# EAGLE design time-shift-r1 (EAGLE 6.5.0)
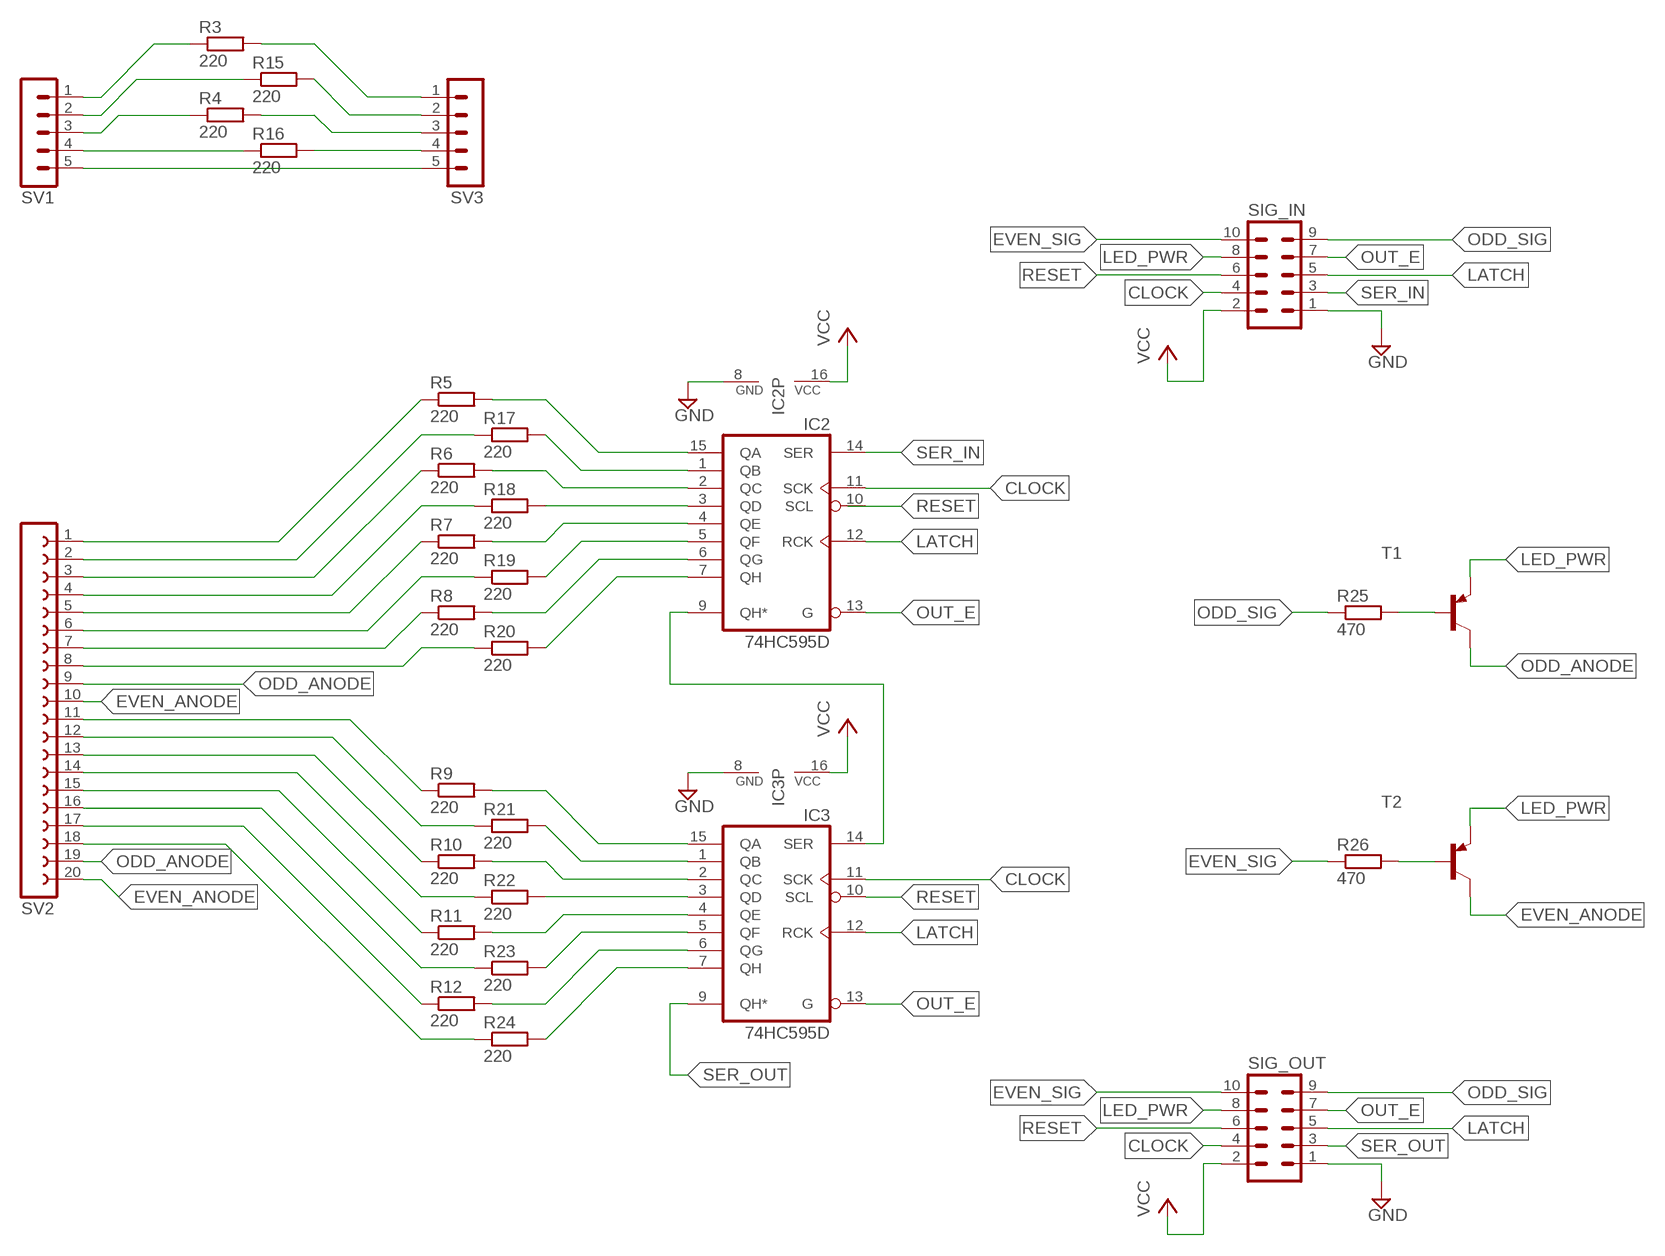
[diagram p0: schematic, sheet 1]

## Parts
IC2  74HC595D  [SO16]
IC3  74HC595D  [SO16]
R3  220  R-EU_R0805  [R0805]
R4  220  R-EU_R0805  [R0805]
R5  220  R-EU_R0805  [R0805]
R6  220  R-EU_R0805  [R0805]
R7  220  R-EU_R0805  [R0805]
R8  220  R-EU_R0805  [R0805]
R9  220  R-EU_R0805  [R0805]
R10  220  R-EU_R0805  [R0805]
R11  220  R-EU_R0805  [R0805]
R12  220  R-EU_R0805  [R0805]
R15  220  R-EU_R0805  [R0805]
R16  220  R-EU_R0805  [R0805]
R17  220  R-EU_R0805  [R0805]
R18  220  R-EU_R0805  [R0805]
R19  220  R-EU_R0805  [R0805]
R20  220  R-EU_R0805  [R0805]
R21  220  R-EU_R0805  [R0805]
R22  220  R-EU_R0805  [R0805]
R23  220  R-EU_R0805  [R0805]
R24  220  R-EU_R0805  [R0805]
R25  470  R-EU_R0805  [R0805]
R26  470  R-EU_R0805  [R0805]
SIG_IN  MA05-2  [MA05-2]
SIG_OUT  MA05-2  [MA05-2]
SV1  MA05-1  [MA05-1]
SV2  FE20-1  [FE20]
SV3  MA05-1  [MA05-1]
T1  BC557B-PNP-TO92-EBC  [TO92-EBC]
T2  BC557B-PNP-TO92-EBC  [TO92-EBC]

## Nets
CLOCK: IC2.11(SCK) IC3.11(SCK) SIG_IN.4 SIG_OUT.4
EVEN_ANODE: SV2.10 SV2.20 T2.C
EVEN_SIG: R26.1 SIG_IN.10 SIG_OUT.10
GND: IC2.8(GND) IC3.8(GND) SIG_IN.1 SIG_OUT.1
LATCH: IC2.12(RCK) IC3.12(RCK) SIG_IN.5 SIG_OUT.5
LED_PWR: SIG_IN.8 SIG_OUT.8 T1.E T2.E
N$1: IC2.15(QA) R5.2
N$2: IC2.2(QC) R6.2
N$3: IC2.4(QE) R7.2
N$4: IC2.6(QG) R8.2
N$5: R20.1 SV2.8
N$6: R19.1 SV2.6
N$7: R18.1 SV2.4
N$8: R17.1 SV2.2
N$9: IC2.1(QB) R17.2
N$10: IC2.3(QD) R18.2
N$11: IC2.5(QF) R19.2
N$12: IC2.7(QH) R20.2
N$13: IC3.15(QA) R9.2
N$14: IC3.2(QC) R10.2
N$15: IC3.4(QE) R11.2
N$16: IC3.6(QG) R12.2
N$17: R24.1 SV2.18
N$18: R23.1 SV2.16
N$19: R22.1 SV2.14
N$20: R21.1 SV2.12
N$21: IC3.1(QB) R21.2
N$22: IC3.3(QD) R22.2
N$23: IC3.5(QF) R23.2
N$24: IC3.7(QH) R24.2
N$25: IC2.9(QH*) IC3.14(SER)
N$26: R5.1 SV2.1
N$27: R6.1 SV2.3
N$28: R7.1 SV2.5
N$29: R8.1 SV2.7
N$30: R9.1 SV2.11
N$31: R10.1 SV2.13
N$32: R11.1 SV2.15
N$33: R12.1 SV2.17
N$36: R16.1 SV1.4
N$37: R4.1 SV1.3
N$38: R3.2 SV3.1
N$39: R4.2 SV3.3
N$40: R15.1 SV1.2
N$41: R3.1 SV1.1
N$42: SV1.5 SV3.5
N$43: R15.2 SV3.2
N$44: R16.2 SV3.4
N$53: R26.2 T2.B
N$54: R25.2 T1.B
ODD_ANODE: SV2.9 SV2.19 T1.C
ODD_SIG: R25.1 SIG_IN.9 SIG_OUT.9
OUT_E: IC2.13(G) IC3.13(G) SIG_IN.7 SIG_OUT.7
RESET: IC3.10(SCL) SIG_IN.6 SIG_OUT.6
SER_IN: IC2.14(SER) SIG_IN.3
SER_OUT: IC3.9(QH*) SIG_OUT.3
VCC: IC2.16(VCC) IC3.16(VCC) SIG_IN.2 SIG_OUT.2
Unconnected: IC2.10(SCL)

## Library data of the parts
IC2 IC3 = 74xx-eu:74*595: 8-bit SHIFT REGISTER, output latch
R3-R12 R15-R26 = rcl:R-EU_: RESISTOR, European symbol
SIG_IN SIG_OUT = con-lstb:MA05-2: PIN HEADER; OC_FARNELL: unknown; OC_NEWARK: unknown
SV1 SV3 = con-lstb:MA05-1: PIN HEADER; OC_FARNELL: unknown; OC_NEWARK: unknown
SV2 = con-lsta:FE20-1: FEMALE HEADER; OC_FARNELL: unknown; OC_NEWARK: unknown
T1 T2 = transistor:*-PNP-: PNP Transistror

## Board
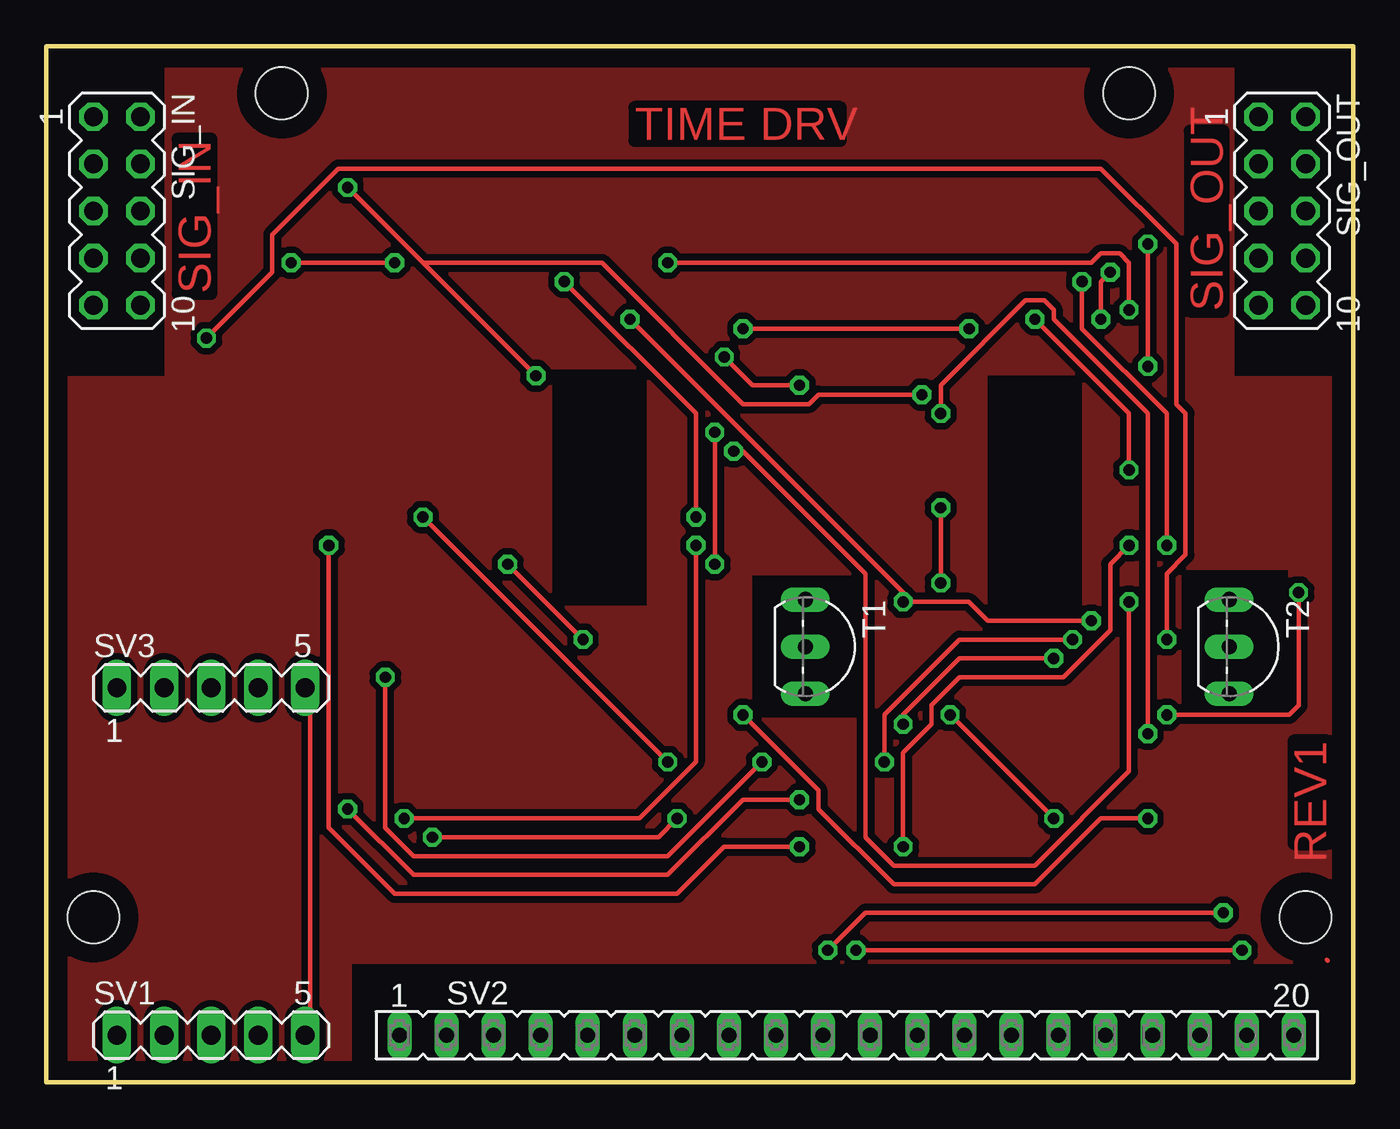
[diagram p1: board, top side]
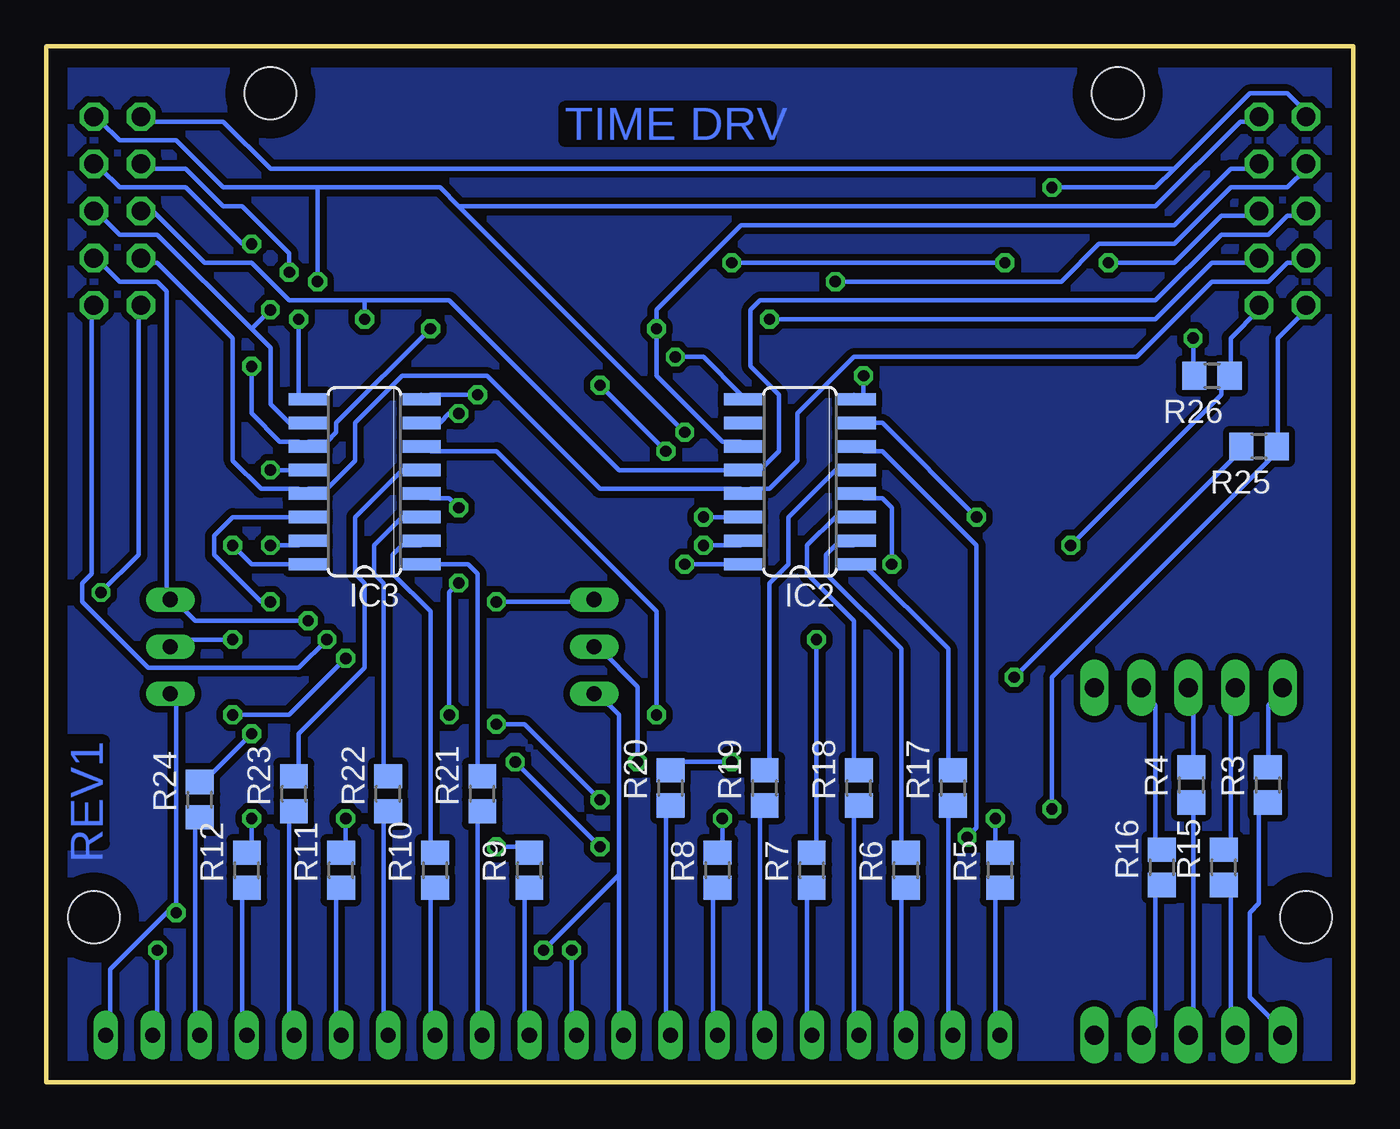
[diagram p2: board, bottom side, seen from below]

Size 70.51 x 55.87 mm. Coordinates in mm from the lower left corner, seen from the top.
Outline: 0,0 70.51,0 70.51,55.87 0,55.87 0,0
Copper layers (1*16): Top 0.035mm / dielectric 1.5mm / Bottom 0.035mm
Design rules "default *": minimum track width 10mil, minimum drill 24mil, track to track 14mil, track to pad 14mil, pad to pad 14mil, via to via 14mil, smd to smd 14mil, copper to edge 40mil, drill to drill 8mil, minimum pad ring 10mil, minimum via ring 8mil, stop-mask expansion 4mil, vias tented up to drill 0mil, thermal gap 10mil
Holes 2.8 mm at 12.7,53.34 58.42,53.34 2.54,8.89 67.94,8.89
tRestrict: area 16.5,1.3 to 69.8,6.3; area 1.3,38.1 to 6.3,58.4; area 64.1,38.1 to 69.2,58.4; area 27.3,25.7 to 32.4,38.4; area 50.8,25.4 to 55.9,38.1; area 61.3,20 to 67,27.6; area 38.1,19.7 to 43.8,27.3

### Footprints (pad centres in the part's own frame; a part is rotated, then mirrored left to right if it is on the bottom)
SO16 = smd 0.66 x 2.032: 1 -4.445,-3.073; 2 -3.175,-3.073; 3 -1.905,-3.073; 4 -0.635,-3.073; 5 0.635,-3.073; 6 1.905,-3.073; 7 3.175,-3.073; 8 4.445,-3.073; 9 4.445,3.073; 10 3.175,3.073; 11 1.905,3.073; 12 0.635,3.073; 13 -0.635,3.073; 14 -1.905,3.073; 15 -3.175,3.073; 16 -4.445,3.073
R0805 = smd 1.3 x 1.5: 1 -0.95,0; 2 0.95,0
MA05-2 = drill 1.016 octagon: 1 -5.08,-1.27; 2 -5.08,1.27; 3 -2.54,-1.27; 4 -2.54,1.27; 5 0,-1.27; 6 0,1.27; 7 2.54,-1.27; 8 2.54,1.27; 9 5.08,-1.27; 10 5.08,1.27
MA05-1 = drill 1.016 long: 1 -5.08,0; 2 -2.54,0; 3 0,0; 4 2.54,0; 5 5.08,0
FE20 = drill 0.813 long: 1 -24.13,0; 2 -21.59,0; 3 -19.05,0; 4 -16.51,0; 5 -13.97,0; 6 -11.43,0; 7 -8.89,0; 8 -6.35,0; 9 -3.81,0; 10 -1.27,0; 11 1.27,0; 12 3.81,0; 13 6.35,0; 14 8.89,0; 15 11.43,0; 16 13.97,0; 17 16.51,0; 18 19.05,0; 19 21.59,0; 20 24.13,0
TO92-EBC = drill 0.813 long: B 0,-1.27; C 2.54,-1.27; E -2.54,-1.27

### Placement (x,y rotation side)
IC2  29.84,32.38 90 bottom
IC3  53.34,32.38 90 bottom
R3  4.6,16.03 90 bottom
R4  8.73,16.03 90 bottom
R5  19.05,11.43 90 bottom
R6  24.13,11.43 90 bottom
R7  29.21,11.43 90 bottom
R8  34.29,11.43 90 bottom
R9  44.45,11.43 90 bottom
R10  49.53,11.43 90 bottom
R11  54.61,11.43 90 bottom
R12  59.69,11.43 90 bottom
R15  6.99,11.59 90 bottom
R16  10.32,11.59 90 bottom
R17  21.59,15.88 90 bottom
R18  26.67,15.88 90 bottom
R19  31.75,15.88 90 bottom
R20  36.83,15.88 90 bottom
R21  46.99,15.56 90 bottom
R22  52.07,15.56 90 bottom
R23  57.15,15.56 90 bottom
R24  62.23,15.24 90 bottom
R25  5.08,34.29 180 bottom
R26  7.62,38.1 180 bottom
SIG_IN  3.81,46.99 270 top
SIG_OUT  66.67,46.99 270 top
SV1  8.89,2.54 0 top
SV2  43.18,2.54 0 top
SV3  8.89,21.27 0 top
T1  42.23,23.5 270 top
T2  65.09,23.5 270 top

### Tracks (layer width: path | path; a pad name or v marks a point on that pad's centre or on a via)
CLOCK  (via drill 0.61)
  Top 0.254: v37.59,40.64 v49.78,40.64 | v59.44,38.61 v59.44,45.21
  Bottom 0.254: IC2.11 33.02,34.54 34.04,34.54 37.59,38.1 v37.59,40.64 37.59,41.66 33.02,46.23 9.65,46.23 6.6,49.28 5.08,49.28 SIG_IN.4 | v49.78,40.64 54.86,35.56 54.86,35.05 55.37,34.54 56.39,34.54 IC3.11 56.9,34.54 57.91,34.54 59.44,36.07 v59.44,38.61 | v59.44,45.21 59.94,45.21 62.99,48.26 66.55,48.26 67.56,49.28 SIG_OUT.4
EVEN_ANODE  (via drill 0.61)
  Top 0.254: v42.16,7.11 44.2,9.14 v63.5,9.14
  Bottom 0.254: v42.16,7.11 42.16,2.54 SV2.10 | 63.5,9.65 63.5,20.83 T2.C | 63.5,9.65 v63.5,9.14 | 63.5,9.65 67.06,6.1 67.06,2.54 SV2.20
EVEN_SIG  (via drill 0.61)
  Top 0.254: v55.37,23.88 49.28,23.88 45.21,19.81 v45.21,17.27 | v40.64,12.7 36.58,12.7 34.04,10.16 18.8,10.16 15.24,13.72 v15.24,28.96
  Bottom 0.254: SIG_IN.10 5.08,41.66 6.6,40.13 6.6,38.1 R26.1 7.11,38.1 7.11,37.08 v15.24,28.96 | v55.37,23.88 56.9,22.35 65.02,22.35 68.58,25.91 68.58,26.92 68.07,27.43 68.07,41.66 SIG_OUT.10 | v40.64,12.7 v45.21,17.27
GND  (via drill 0.61)
  Top 0.254: v16.26,48.26 20.32,44.2 | 20.32,44.2 v26.42,38.1 | v47.24,37.08 41.66,37.08 41.15,36.58 37.59,36.58 29.97,44.2 20.32,44.2
  Bottom 0.254: 50.29,37.08 IC3.8 49.78,37.08 v47.24,37.08 | 26.92,37.08 IC2.8 26.42,37.08 v26.42,38.1 | v16.26,48.26 10.67,48.26 9.65,49.28 | 9.65,49.28 5.59,53.34 3.56,53.34 2.54,52.32 SIG_IN.1 | 9.65,49.28 58.42,49.28 60.96,51.82 65.02,51.82 SIG_OUT.1
LATCH  (via drill 0.61)
  Top 0.254: v58.42,33.02 58.42,36.07 v53.34,41.15
  Bottom 0.254: 53.34,42.16 57.4,42.16 59.44,44.2 61.98,44.2 65.02,47.24 SIG_OUT.5 | 53.34,42.16 48.77,42.16 39.62,33.02 IC2.12 32,33.02 30.99,34.04 30.99,37.08 32.51,38.61 32.51,41.66 32,42.16 10.67,42.16 7.11,45.72 4.57,45.72 3.56,46.74 2.54,46.74 SIG_IN.5 | v58.42,33.02 IC3.12 | 53.34,42.16 v53.34,41.15
LED_PWR  (via drill 0.61)
  Top 0.254: 46.74,25.91 49.78,25.91 50.8,24.89 v56.39,24.89 | 46.74,25.91 v46.23,25.91 | 46.74,25.91 v31.5,41.15
  Bottom 0.254: v46.23,25.91 41.15,25.91 T1.E | v56.39,24.89 62.48,24.89 63.5,25.91 T2.E 64.01,26.42 64.01,42.67 64.52,43.18 66.55,43.18 67.56,44.2 SIG_OUT.8 | v31.5,41.15 10.67,41.15 7.62,44.2 5.08,44.2 SIG_IN.8
N$1  (via drill 0.61)
  Top 0.254: v19.3,14.22 32,14.22 35.05,17.27 v35.05,28.96
  Bottom 0.254: v19.3,14.22 19.3,12.7 R5.2 | v35.05,28.96 33.02,28.96 IC2.15
N$2
  Bottom 0.254: R6.2 24.38,12.7 24.38,23.37 28.45,27.43 28.45,28.45 27.94,28.96 26.92,28.96 IC2.2
N$3  (via drill 0.61)
  Top 0.254: v24.89,27.94 v28.96,23.88
  Bottom 0.254: v28.96,23.88 28.96,12.7 R7.2 | v24.89,27.94 24.89,30.99 25.4,31.5 26.42,31.5 IC2.4
N$4  (via drill 0.61)
  Top 0.254: v34.04,14.22 33.02,13.21 v20.83,13.21
  Bottom 0.254: v34.04,14.22 34.04,12.7 R8.2 | v20.83,13.21 20.32,13.72 20.32,28.96 25.4,34.04 26.42,34.04 IC2.6
N$5
  Bottom 0.254: R20.1 37.08,14.73 37.08,2.54 SV2.8
N$6
  Bottom 0.254: R19.1 32,14.73 32,2.54 SV2.6
N$7
  Bottom 0.254: R18.1 26.92,14.73 26.92,2.54 SV2.4
N$8
  Bottom 0.254: R17.1 21.84,14.73 21.84,2.54 SV2.2
N$9
  Bottom 0.254: R17.2 21.84,17.27 21.84,23.37 26.42,27.94 IC2.1
N$10
  Bottom 0.254: IC2.3 27.94,30.48 29.46,28.96 29.46,27.43 26.92,24.89 26.92,17.27 R18.2
N$11
  Bottom 0.254: IC2.5 27.94,33.02 30.48,30.48 30.48,27.94 31.5,26.92 31.5,17.27 R19.2
N$12  (via drill 0.61)
  Top 0.254: v20.32,30.48 v33.53,17.27
  Bottom 0.254: v33.53,17.27 36.58,17.27 R20.2 | v20.32,30.48 25.4,35.56 IC2.7
N$13  (via drill 0.61)
  Top 0.254: v46.23,12.7 46.23,17.78 47.75,19.3 47.75,20.32 49.28,21.84 54.86,21.84 57.4,24.38 57.4,27.94 v58.42,28.96
  Bottom 0.254: v46.23,12.7 44.7,12.7 R9.2 | v58.42,28.96 56.9,28.96 IC3.15
N$14
  Bottom 0.254: R10.2 49.78,12.7 49.78,25.4 51.82,27.43 51.82,28.45 51.31,28.96 50.29,28.96 IC3.2
N$15  (via drill 0.61)
  Top 0.254: v48.77,19.81 v54.36,14.22 | v48.26,30.99 v48.26,26.92
  Bottom 0.254: v54.36,14.22 54.36,12.7 R11.2 | v48.77,19.81 48.77,26.42 v48.26,26.92 | v48.26,30.99 48.77,31.5 49.78,31.5 IC3.4
N$16  (via drill 0.61)
  Top 0.254: v59.44,14.22 56.9,14.22 53.34,10.67 45.72,10.67 41.66,14.73 41.66,15.75 v37.59,19.81
  Bottom 0.254: v59.44,14.22 59.44,12.7 R12.2 | v37.59,19.81 37.59,25.4 46.23,34.04 49.78,34.04 IC3.6
N$17
  Bottom 0.254: R24.1 62.48,14.22 62.48,2.54 SV2.18
N$18
  Bottom 0.254: R23.1 57.4,14.22 57.4,2.54 SV2.16
N$19
  Bottom 0.254: R22.1 52.32,14.22 52.32,2.54 SV2.14
N$20
  Bottom 0.254: R21.1 47.24,14.22 47.24,2.54 SV2.12
N$21
  Bottom 0.254: IC3.1 47.75,27.94 47.24,27.43 47.24,16.76 R21.2
N$22
  Bottom 0.254: IC3.3 51.31,30.48 52.83,28.96 52.83,27.43 52.32,26.92 52.32,16.76 R22.2
N$23
  Bottom 0.254: IC3.5 51.31,33.02 53.85,30.48 53.85,27.43 53.34,26.92 53.34,22.35 56.9,18.8 56.9,16.76 R23.2
N$24  (via drill 0.61)
  Top 0.254: v59.44,18.8 59.44,36.07 54.36,41.15 54.36,41.66 53.85,42.16 52.83,42.16 48.26,37.59 v48.26,36.07
  Bottom 0.254: v59.44,18.8 61.98,16.26 R24.2 | v48.26,36.07 48.77,36.07 49.28,35.56 IC3.7
N$25  (via drill 0.61)
  Top 0.254: v58.42,25.91 58.42,16.76 53.34,11.68 45.72,11.68 44.2,13.21 44.2,27.43 37.59,34.04 v37.08,34.04 | v40.64,37.59 38.1,37.59 v36.58,39.12
  Bottom 0.254: IC3.14 60.45,30.48 61.47,29.46 61.47,28.45 58.93,25.91 v58.42,25.91 | v40.64,37.59 v37.08,34.04 | v36.58,39.12 35.05,39.12 33.02,37.08 IC2.9
N$26
  Bottom 0.254: R5.1 19.3,10.16 19.3,2.54 SV2.1
N$27
  Bottom 0.254: R6.1 24.38,10.16 24.38,2.54 SV2.3
N$28
  Bottom 0.254: R7.1 29.46,10.16 29.46,2.54 SV2.5
N$29
  Bottom 0.254: R8.1 34.54,10.16 34.54,2.54 SV2.7
N$30
  Bottom 0.254: R9.1 44.7,10.16 44.7,2.54 SV2.11
N$31
  Bottom 0.254: R10.1 49.78,10.16 49.78,2.54 SV2.13
N$32
  Bottom 0.254: R11.1 54.86,10.16 54.86,2.54 SV2.15
N$33
  Bottom 0.254: R12.1 59.94,10.16 59.94,2.54 SV2.17
N$34
  pour Bottom: 0,55.88 70.48,55.88 70.48,-0.64 0,-0.64
N$35
  Top 0.254: 69.09,6.6 69.14,6.55
N$36
  Bottom 0.254: R16.1 10.67,10.16 10.67,3.05 11.18,2.54 SV1.4
N$37
  Bottom 0.254: R4.1 8.64,14.73 8.64,2.54 SV1.3
N$38
  Bottom 0.254: R3.2 4.57,17.27 4.57,20.32 4.06,20.83 SV3.1
N$39
  Bottom 0.254: R4.2 8.64,17.27 8.64,20.83 SV3.3
N$40
  Bottom 0.254: R15.1 6.6,10.16 6.6,2.54 SV1.2
N$41
  Bottom 0.254: R3.1 5.08,14.73 5.08,9.65 5.59,9.14 5.59,4.57 3.56,2.54 SV1.1
N$42
  Top 0.254: SV1.5 14.22,2.54 14.22,20.83 SV3.5
N$43
  Bottom 0.254: R15.2 6.6,12.7 6.6,20.83 SV3.2
N$44
  Bottom 0.254: R16.2 10.67,12.7 10.67,20.32 11.18,20.83 SV3.4
N$45
  pour Top: 0,55.88 71.12,55.88 71.12,0 0,0
N$53  (via drill 0.61)
  Top 0.254: v8.64,40.13 12.19,43.69 12.19,45.72 15.75,49.28 56.9,49.28 60.96,45.21 60.96,36.58 61.47,36.07 61.47,28.45 60.45,27.43 v60.45,23.88
  Bottom 0.254: v8.64,40.13 8.64,38.1 R26.2 | v60.45,23.88 63.5,23.88 T2.B
N$54  (via drill 0.61)
  Top 0.254: v18.29,21.84 18.29,13.72 19.81,12.19 33.53,12.19 v38.61,17.27
  Bottom 0.254: v18.29,21.84 6.1,34.04 R25.2 | v38.61,17.27 38.61,21.34 40.64,23.37 T1.B
ODD_ANODE  (via drill 0.61)
  Top 0.254: v43.69,7.11 v64.52,7.11
  Bottom 0.254: 39.62,11.18 39.62,19.81 40.64,20.83 T1.C | 39.62,11.18 39.62,2.54 SV2.9 | v64.52,7.11 64.52,2.54 SV2.19 | 39.62,11.18 v43.69,7.11
ODD_SIG  (via drill 0.61)
  Top 0.254: v67.56,26.42 67.56,20.32 67.06,19.81 v60.45,19.81 | v54.36,22.86 49.28,22.86 46.23,19.81 v46.23,19.3 | v40.64,15.24 37.59,15.24 33.53,11.18 19.81,11.18 v16.26,14.73
  Bottom 0.254: SIG_IN.9 2.54,41.66 4.06,40.13 4.06,34.54 R25.1 4.06,34.04 16.26,21.84 v16.26,14.73 | v67.56,26.42 65.53,28.45 65.53,41.66 SIG_OUT.9 | v60.45,19.81 57.4,19.81 v54.36,22.86 | v46.23,19.3 44.7,19.3 v40.64,15.24
OUT_E
  Bottom 0.254: SIG_IN.7 2.54,44.2 3.56,44.2 4.57,43.18 7.62,43.18 11.68,39.12 26.92,39.12 29.97,36.07 29.97,33.53 31.5,32 32.51,32 IC2.13 33.02,32 40.64,32 46.74,38.1 51.31,38.1 53.85,35.56 53.85,33.53 55.37,32 56.39,32 IC3.13 56.9,32 58.93,32 60.45,33.53 60.45,40.13 64.52,44.2 65.02,44.2 SIG_OUT.7
RESET  (via drill 0.61)
  Top 0.254: v18.8,44.2 v13.21,44.2 | v33.53,44.2 56.39,44.2 56.9,44.7 57.91,44.7 58.42,44.2 v58.42,41.66
  Bottom 0.254: IC3.10 57.4,35.56 58.42,36.58 58.42,39.62 59.44,40.64 | 59.44,40.64 64.52,45.72 66.55,45.72 67.56,46.74 SIG_OUT.6 | v13.21,44.2 9.65,44.2 7.11,46.74 5.08,46.74 SIG_IN.6 | v33.53,44.2 v18.8,44.2 | 59.44,40.64 v58.42,41.66
SER_IN  (via drill 0.61)
  Top 0.254: v35.05,30.48 35.05,36.07 v27.94,43.18
  Bottom 0.254: v35.05,30.48 IC2.14 | v27.94,43.18 15.75,43.18 13.72,45.21 9.65,45.21 6.6,48.26 3.56,48.26 2.54,49.28 SIG_IN.3
SER_OUT  (via drill 0.61)
  Top 0.254: v56.9,41.15 56.9,43.18 v57.4,43.69
  Bottom 0.254: v56.9,41.15 56.9,37.08 IC3.9 | v57.4,43.69 57.4,44.7 59.94,47.24 60.96,47.24 62.99,49.28 65.02,49.28 SIG_OUT.3
VCC  (via drill 0.61)
  Top 0.254: v36.07,35.05 v36.07,27.94 | v60.45,28.96 60.45,36.07 55.88,40.64 v55.88,43.18
  Bottom 0.254: v36.07,27.94 33.02,27.94 IC2.16 | 48.26,47.24 49.28,48.26 55.88,48.26 | 48.26,47.24 v36.07,35.05 | 55.88,48.26 60.96,48.26 63.5,50.8 66.55,50.8 67.56,51.82 SIG_OUT.2 | v60.45,28.96 59.44,27.94 56.9,27.94 IC3.16 | 55.88,48.26 v55.88,43.18 | 48.26,47.24 10.67,47.24 6.1,51.82 5.08,51.82 SIG_IN.2

### Text on the board
Top: TIME DRV | SIG_IN | SIG_OUT | REV1
Bottom: TIME DRV | REV1